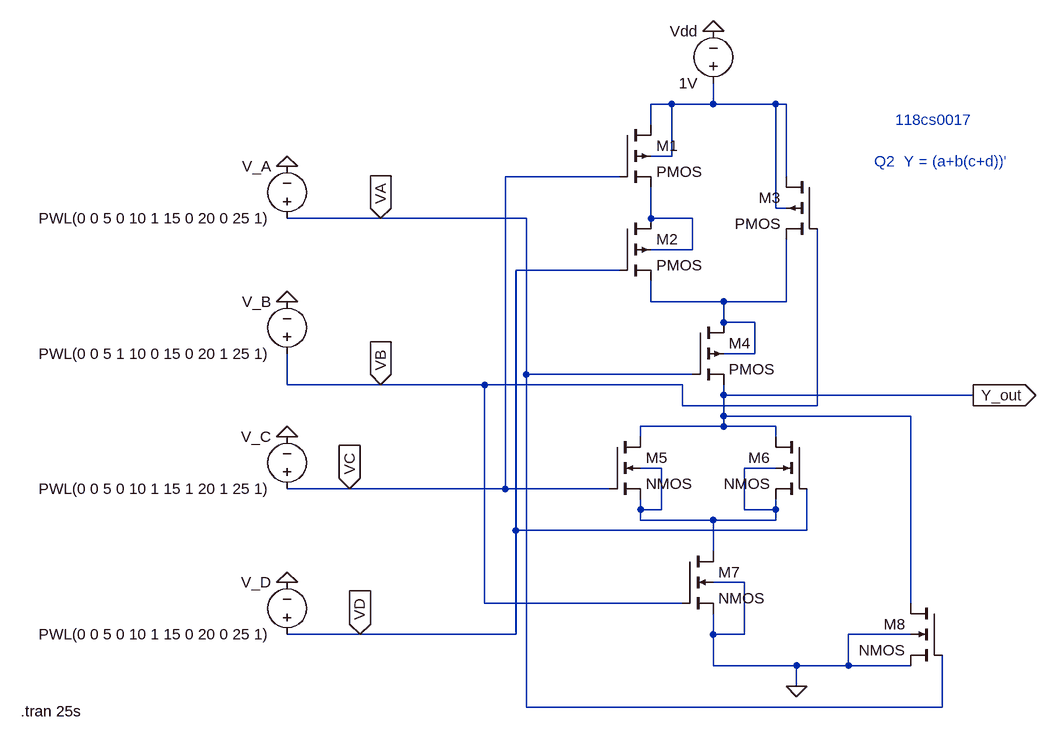
[diagram p0: schematic Draft16.asc]
Draft16.asc, the LTspice schematic file:
Version 4
SHEET 1 880 936
WIRE 144 -16 112 -16
WIRE 208 -16 208 -48
WIRE 208 -16 144 -16
WIRE 304 -16 208 -16
WIRE 320 -16 304 -16
WIRE 112 16 112 -16
WIRE 144 64 144 -16
WIRE 144 64 112 64
WIRE 64 96 -112 96
WIRE 320 96 320 -16
WIRE 304 144 304 -16
WIRE 320 144 304 144
WIRE -304 160 -448 160
WIRE -80 160 -304 160
WIRE 112 160 112 112
WIRE 176 160 112 160
WIRE 176 208 176 160
WIRE 176 208 112 208
WIRE 64 240 -96 240
WIRE 112 288 112 256
WIRE 224 288 112 288
WIRE 320 288 320 192
WIRE 320 288 224 288
WIRE 224 320 224 288
WIRE 272 320 224 320
WIRE 272 368 272 320
WIRE 272 368 224 368
WIRE -80 400 -80 160
WIRE 176 400 -80 400
WIRE -448 416 -448 368
WIRE -304 416 -448 416
WIRE -144 416 -304 416
WIRE 160 416 -144 416
WIRE 224 432 224 416
WIRE 608 432 224 432
WIRE 160 448 160 416
WIRE 368 448 368 176
WIRE 368 448 160 448
WIRE 224 464 224 432
WIRE 512 464 224 464
WIRE 224 480 224 464
WIRE 224 480 96 480
WIRE 304 480 224 480
WIRE 96 496 96 480
WIRE 304 496 304 480
WIRE 128 544 96 544
WIRE 304 544 256 544
WIRE -352 576 -448 576
WIRE -112 576 -112 96
WIRE -112 576 -352 576
WIRE 48 576 -112 576
WIRE 96 608 96 592
WIRE 128 608 128 544
WIRE 128 608 96 608
WIRE 256 608 256 544
WIRE 304 608 304 592
WIRE 304 608 256 608
WIRE 96 624 96 608
WIRE 208 624 96 624
WIRE 304 624 304 608
WIRE 304 624 208 624
WIRE -96 640 -96 240
WIRE 352 640 352 576
WIRE 352 640 -96 640
WIRE 208 672 208 624
WIRE 256 720 208 720
WIRE -144 752 -144 416
WIRE 160 752 -144 752
WIRE 512 752 512 464
WIRE -336 800 -448 800
WIRE -96 800 -96 640
WIRE -96 800 -336 800
WIRE 208 800 208 768
WIRE 256 800 256 720
WIRE 256 800 208 800
WIRE 512 800 416 800
WIRE 208 848 208 800
WIRE 336 848 208 848
WIRE 416 848 416 800
WIRE 416 848 336 848
WIRE 512 848 416 848
WIRE 336 880 336 848
WIRE -80 912 -80 400
WIRE 560 912 560 832
WIRE 560 912 -80 912
FLAG 608 432 Y_out
IOPIN 608 432 Out
FLAG 336 880 0
FLAG -448 80 0
FLAG -448 288 0
FLAG -448 496 0
FLAG -448 720 0
FLAG 208 -128 0
FLAG -304 160 VA
IOPIN -304 160 In
FLAG -304 416 VB
IOPIN -304 416 In
FLAG -352 576 VC
IOPIN -352 576 In
FLAG -336 800 VD
IOPIN -336 800 In
SYMBOL pmos4 64 16 R0
SYMATTR InstName M1
SYMBOL pmos4 64 160 R0
SYMATTR InstName M2
SYMBOL pmos4 368 96 M0
SYMATTR InstName M3
SYMBOL pmos4 176 320 R0
SYMATTR InstName M4
SYMBOL nmos4 48 496 R0
SYMATTR InstName M5
SYMBOL nmos4 352 496 M0
SYMATTR InstName M6
SYMBOL nmos4 160 672 R0
SYMATTR InstName M7
SYMBOL nmos4 560 752 M0
SYMATTR InstName M8
SYMBOL voltage 208 -32 R180
WINDOW 0 24 96 Left 2
WINDOW 3 24 16 Left 2
SYMATTR InstName Vdd
SYMATTR Value 1V
SYMBOL voltage -448 816 R180
WINDOW 0 24 96 Left 2
WINDOW 3 24 16 Left 2
WINDOW 123 0 0 Left 0
WINDOW 39 0 0 Left 0
SYMATTR InstName V_D
SYMATTR Value PWL(0 0 5 0 10 1 15 0 20 0 25 1)
SYMBOL voltage -448 592 R180
WINDOW 0 24 96 Left 2
WINDOW 3 24 16 Left 2
WINDOW 123 0 0 Left 0
WINDOW 39 0 0 Left 0
SYMATTR InstName V_C
SYMATTR Value PWL(0 0 5 0 10 1 15 1 20 1 25 1)
SYMBOL voltage -448 384 R180
WINDOW 0 24 96 Left 2
WINDOW 3 24 16 Left 2
WINDOW 123 0 0 Left 0
WINDOW 39 0 0 Left 0
SYMATTR InstName V_B
SYMATTR Value PWL(0 0 5 1 10 0 15 0 20 1 25 1)
SYMBOL voltage -448 176 R180
WINDOW 0 24 96 Left 2
WINDOW 3 24 16 Left 2
WINDOW 123 0 0 Left 0
WINDOW 39 0 0 Left 0
SYMATTR InstName V_A
SYMATTR Value PWL(0 0 5 0 10 1 15 0 20 0 25 1)
TEXT -858 918 Left 2 !.tran 25s
TEXT 488 8 Left 2 ;118cs0017
TEXT 456 72 Left 2 ;Q2  Y = (a+b(c+d))'

The netlist it stands for:
* Draft16.asc
M1 N001 VC N002 N001 PMOS
M2 N002 VD N003 N002 PMOS
M3 N001 VB N003 N001 PMOS
M4 N003 VA Y_out N003 PMOS
M5 Y_out VC N004 N004 NMOS
M6 Y_out VD N004 N004 NMOS
M7 N004 VB 0 0 NMOS
M8 Y_out VA 0 0 NMOS
Vdd N001 0 1V
V_D VD 0 PWL(0 0 5 0 10 1 15 0 20 0 25 1)
V_C VC 0 PWL(0 0 5 0 10 1 15 1 20 1 25 1)
V_B VB 0 PWL(0 0 5 1 10 0 15 0 20 1 25 1)
V_A VA 0 PWL(0 0 5 0 10 1 15 0 20 0 25 1)
.model NMOS NMOS
.model PMOS PMOS
.lib standard.mos
.tran 25s
* 118cs0017
* Q2  Y = (a+b(c+d))'
.backanno
.end